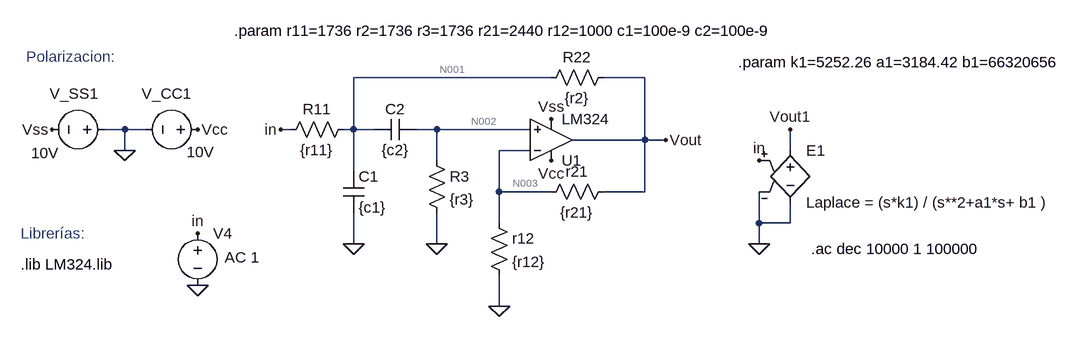
[diagram p0: schematic TP4.asc]
TP4.asc, the LTspice schematic file:
Version 4
SHEET 1 940 680
WIRE -160 16 -464 16
WIRE -16 16 -80 16
WIRE -816 96 -848 96
WIRE -784 96 -816 96
WIRE -560 96 -576 96
WIRE -464 96 -464 16
WIRE -464 96 -480 96
WIRE -432 96 -464 96
WIRE -336 96 -368 96
WIRE -192 96 -336 96
WIRE -16 112 -16 16
WIRE -16 112 -128 112
WIRE 16 112 -16 112
WIRE -816 128 -816 96
WIRE -192 128 -240 128
WIRE 208 128 208 96
WIRE -336 144 -336 96
WIRE -464 160 -464 96
WIRE -240 192 -240 128
WIRE -160 192 -240 192
WIRE -16 192 -16 112
WIRE -16 192 -80 192
WIRE -240 240 -240 192
WIRE 160 240 160 192
WIRE 208 240 208 208
WIRE 208 240 160 240
WIRE -464 272 -464 224
WIRE -336 272 -336 224
WIRE 160 272 160 240
WIRE -240 368 -240 320
FLAG -240 368 0
FLAG -336 272 0
FLAG -464 272 0
FLAG 16 112 Vout
FLAG -160 80 Vss
FLAG 160 272 0
FLAG -704 336 0
FLAG -704 256 in
FLAG -576 96 in
FLAG 160 144 in
FLAG 208 96 Vout1
FLAG -160 144 Vcc
FLAG -704 96 Vcc
FLAG -928 96 Vss
FLAG -816 128 0
SYMBOL cap -368 80 R90
WINDOW 0 0 32 VBottom 2
WINDOW 3 32 32 VTop 2
SYMATTR InstName C2
SYMATTR Value {c2}
SYMBOL res -176 208 R270
WINDOW 0 32 56 VTop 2
WINDOW 3 0 56 VBottom 2
SYMATTR InstName r21
SYMATTR Value {r21}
SYMBOL res -256 224 R0
SYMATTR InstName r12
SYMATTR Value {r12}
SYMBOL res -176 32 R270
WINDOW 0 32 56 VTop 2
WINDOW 3 0 56 VBottom 2
SYMATTR InstName R22
SYMATTR Value {r2}
SYMBOL res -352 128 R0
SYMATTR InstName R3
SYMATTR Value {r3}
SYMBOL cap -480 160 R0
SYMATTR InstName C1
SYMATTR Value {c1}
SYMBOL res -576 112 R270
WINDOW 0 32 56 VTop 2
WINDOW 3 0 56 VBottom 2
SYMATTR InstName R11
SYMATTR Value {r11}
SYMBOL voltage -704 240 R0
WINDOW 123 42 53 Left 2
WINDOW 39 0 0 Left 0
SYMATTR Value2 AC 1
SYMATTR InstName V4
SYMATTR Value ""
SYMBOL e 208 112 R0
SYMATTR InstName E1
SYMATTR Value Laplace = (s*k1) / (s**2+a1*s+ b1 )
SYMBOL voltage -688 96 R90
WINDOW 0 -55 25 VRight 2
WINDOW 3 35 -10 VRight 2
WINDOW 123 0 0 Left 0
WINDOW 39 0 0 Left 0
SYMATTR InstName V_CC1
SYMATTR Value 10V
SYMBOL voltage -832 96 R90
WINDOW 0 -55 25 VRight 2
WINDOW 3 36 85 VRight 2
WINDOW 123 0 0 Left 0
WINDOW 39 0 0 Left 0
SYMATTR InstName V_SS1
SYMATTR Value 10V
SYMBOL OpAmps\\opamp2 -160 176 M180
SYMATTR InstName U1
SYMATTR Value LM324
TEXT 240 280 Left 2 !.ac dec 10000 1 100000
TEXT 128 -8 Left 2 !.param k1=5252.26 a1=3184.42 b1=66320656
TEXT -648 -56 Left 2 !.param r11=1736 r2=1736 r3=1736 r21=2440 r12=1000 c1=100e-9 c2=100e-9
TEXT -976 304 Left 2 !.lib LM324.lib
TEXT -976 256 Left 2 ;Librerías:
TEXT -968 -16 Left 2 ;Polarizacion:

The netlist it stands for:
* TP4.asc
C2 N002 N001 {c2}
r21 N003 Vout {r21}
r12 N003 0 {r12}
R22 N001 Vout {r2}
R3 N002 0 {r3}
C1 N001 0 {c1}
R11 in N001 {r11}
V4 in 0 AC 1
E1 Vout1 0 in 0 Laplace = (s*k1) / (s**2+a1*s+ b1 )
V_CC1 Vcc 0 10V
V_SS1 0 Vss 10V
XU1 N002 N003 Vcc Vss Vout LM324  ; pins In+ In- V+ V- OUT
.ac dec 10000 1 100000
.param k1=5252.26 a1=3184.42 b1=66320656
.param r11=1736 r2=1736 r3=1736 r21=2440 r12=1000 c1=100e-9 c2=100e-9
.lib LM324.lib
* Librerías:
* Polarizacion:
.backanno
.end

* Results of the author's LTspice run, read from the files saved beside the schematic
* Operating Point, zero values left out:
*   V(n002) = 34.59 µV
*   V(n001) = -22.73 µV
*   V(n003) = 928.4 nV
*   V(vout) = -45.46 µV
*   V(vcc) = 10 V
*   V(vss) = -10 V
*   I(R11) = 13.09 nA
*   I(R3) = 19.92 nA
*   I(R22) = 13.09 nA
*   I(R12) = 928.4 pA
*   I(R21) = 19.01 nA
*   I(V_ss1) = -669.8 µA
*   I(V_cc1) = -669.9 µA
*   I(V4) = -13.09 nA
*   Ix(u1:1) = -19.92 nA
*   Ix(u1:2) = -19.94 nA
*   Ix(u1:3) = 669.9 µA
*   Ix(u1:4) = -669.8 µA
*   Ix(u1:5) = 32.1 nA